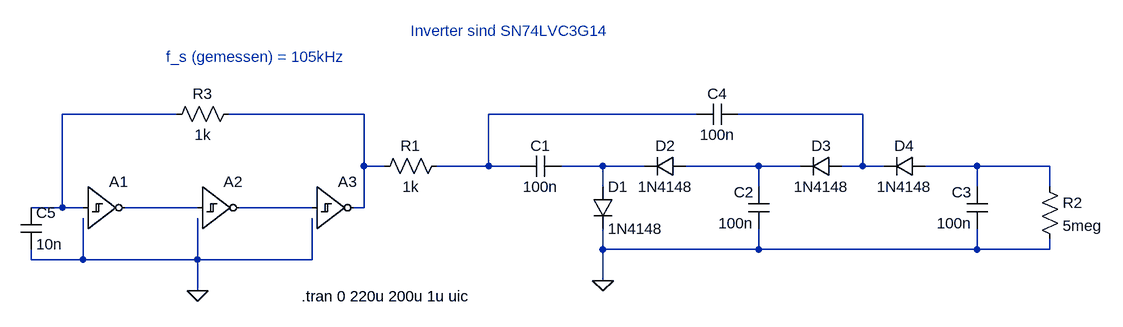
[diagram p0: schematic inverter.asc]
inverter.asc, the LTspice schematic file:
Version 4
SHEET 1 900 680
WIRE -528 -272 -704 -272
WIRE -240 -272 -448 -272
WIRE 272 -272 -48 -272
WIRE 528 -272 336 -272
WIRE -240 -192 -240 -272
WIRE -208 -192 -240 -192
WIRE -48 -192 -48 -272
WIRE -48 -192 -128 -192
WIRE 0 -192 -48 -192
WIRE 128 -192 64 -192
WIRE 192 -192 128 -192
WIRE 368 -192 256 -192
WIRE 432 -192 368 -192
WIRE 528 -192 528 -272
WIRE 528 -192 496 -192
WIRE 560 -192 528 -192
WIRE 704 -192 624 -192
WIRE 816 -192 704 -192
WIRE 128 -160 128 -192
WIRE 368 -160 368 -192
WIRE 704 -160 704 -192
WIRE 816 -160 816 -192
WIRE -704 -128 -704 -272
WIRE -704 -128 -752 -128
WIRE -672 -128 -704 -128
WIRE -496 -128 -608 -128
WIRE -320 -128 -432 -128
WIRE -240 -128 -240 -192
WIRE -240 -128 -256 -128
WIRE 128 -64 128 -96
WIRE 368 -64 368 -96
WIRE 368 -64 128 -64
WIRE 704 -64 704 -96
WIRE 704 -64 368 -64
WIRE 816 -64 816 -80
WIRE 816 -64 704 -64
WIRE -752 -48 -752 -64
WIRE -672 -48 -672 -112
WIRE -672 -48 -752 -48
WIRE -496 -48 -496 -112
WIRE -496 -48 -672 -48
WIRE -320 -48 -320 -112
WIRE -320 -48 -496 -48
WIRE 128 -16 128 -64
WIRE -496 0 -496 -48
FLAG 128 -16 0
FLAG -496 0 0
SYMBOL diode 112 -160 R0
SYMATTR InstName D1
SYMATTR Value 1N4148
SYMBOL cap 64 -208 R90
WINDOW 0 0 32 VBottom 2
WINDOW 3 32 32 VTop 2
SYMATTR InstName C1
SYMATTR Value 100n
SYMBOL diode 256 -208 R90
WINDOW 0 0 32 VBottom 2
WINDOW 3 32 32 VTop 2
SYMATTR InstName D2
SYMATTR Value 1N4148
SYMBOL cap 384 -96 R180
WINDOW 0 24 56 Left 2
WINDOW 3 24 8 Left 2
SYMATTR InstName C2
SYMATTR Value 100n
SYMBOL diode 496 -208 R90
WINDOW 0 0 32 VBottom 2
WINDOW 3 32 32 VTop 2
SYMATTR InstName D3
SYMATTR Value 1N4148
SYMBOL diode 624 -208 R90
WINDOW 0 0 32 VBottom 2
WINDOW 3 32 32 VTop 2
SYMATTR InstName D4
SYMATTR Value 1N4148
SYMBOL cap 720 -96 R180
WINDOW 0 24 56 Left 2
WINDOW 3 24 8 Left 2
SYMATTR InstName C3
SYMATTR Value 100n
SYMBOL cap 272 -256 R270
WINDOW 0 32 32 VTop 2
WINDOW 3 0 32 VBottom 2
SYMATTR InstName C4
SYMATTR Value 100n
SYMBOL res -112 -208 R90
WINDOW 0 0 56 VBottom 2
WINDOW 3 32 56 VTop 2
SYMATTR InstName R1
SYMATTR Value 1k
SYMBOL res 800 -176 R0
SYMATTR InstName R2
SYMATTR Value 5meg
SYMBOL Digital\\schmtinv -672 -192 R0
SYMATTR InstName A1
SYMATTR SpiceLine vhigh=3.3 ref=1.5 Trise=5n Tfall=5n Td=5n
SYMBOL Digital\\schmtinv -496 -192 R0
SYMATTR InstName A2
SYMATTR SpiceLine vhigh=3.3 ref=1.5 Trise=5n Tfall=5n Td=5n
SYMBOL Digital\\schmtinv -320 -192 R0
SYMATTR InstName A3
SYMATTR SpiceLine vhigh=3.3 ref=1.5 Trise=5n Tfall=5n Td=5n
SYMBOL cap -768 -128 R0
SYMATTR InstName C5
SYMATTR Value 10n
SYMBOL res -432 -288 R90
WINDOW 0 0 56 VBottom 2
WINDOW 3 32 56 VTop 2
SYMATTR InstName R3
SYMATTR Value 1k
TEXT -336 8 Left 2 !.tran 0 220u 200u 1u uic
TEXT -168 -400 Left 2 ;Inverter sind SN74LVC3G14
TEXT -544 -360 Left 2 ;f_s (gemessen) = 105kHz

The netlist it stands for:
* inverter.asc
D1 N005 0 1N4148
C1 N005 N003 100n
D2 N006 N005 1N4148
C2 0 N006 100n
D3 N004 N006 1N4148
D4 N007 N004 1N4148
C3 0 N007 100n
C4 N003 N004 100n
R1 N003 N002 1k
R2 N007 0 5meg
A1 N001 0 0 0 0 N008 0 0 SCHMITT vhigh=3.3 ref=1.5 Trise=5n Tfall=5n Td=5n
A2 N008 0 0 0 0 N009 0 0 SCHMITT vhigh=3.3 ref=1.5 Trise=5n Tfall=5n Td=5n
A3 N009 0 0 0 0 N002 0 0 SCHMITT vhigh=3.3 ref=1.5 Trise=5n Tfall=5n Td=5n
C5 N001 0 10n
R3 N002 N001 1k
.model D D
.lib standard.dio
.tran 0 220u 200u 1u uic
* Inverter sind SN74LVC3G14
* f_s (gemessen) = 105kHz
.backanno
.end